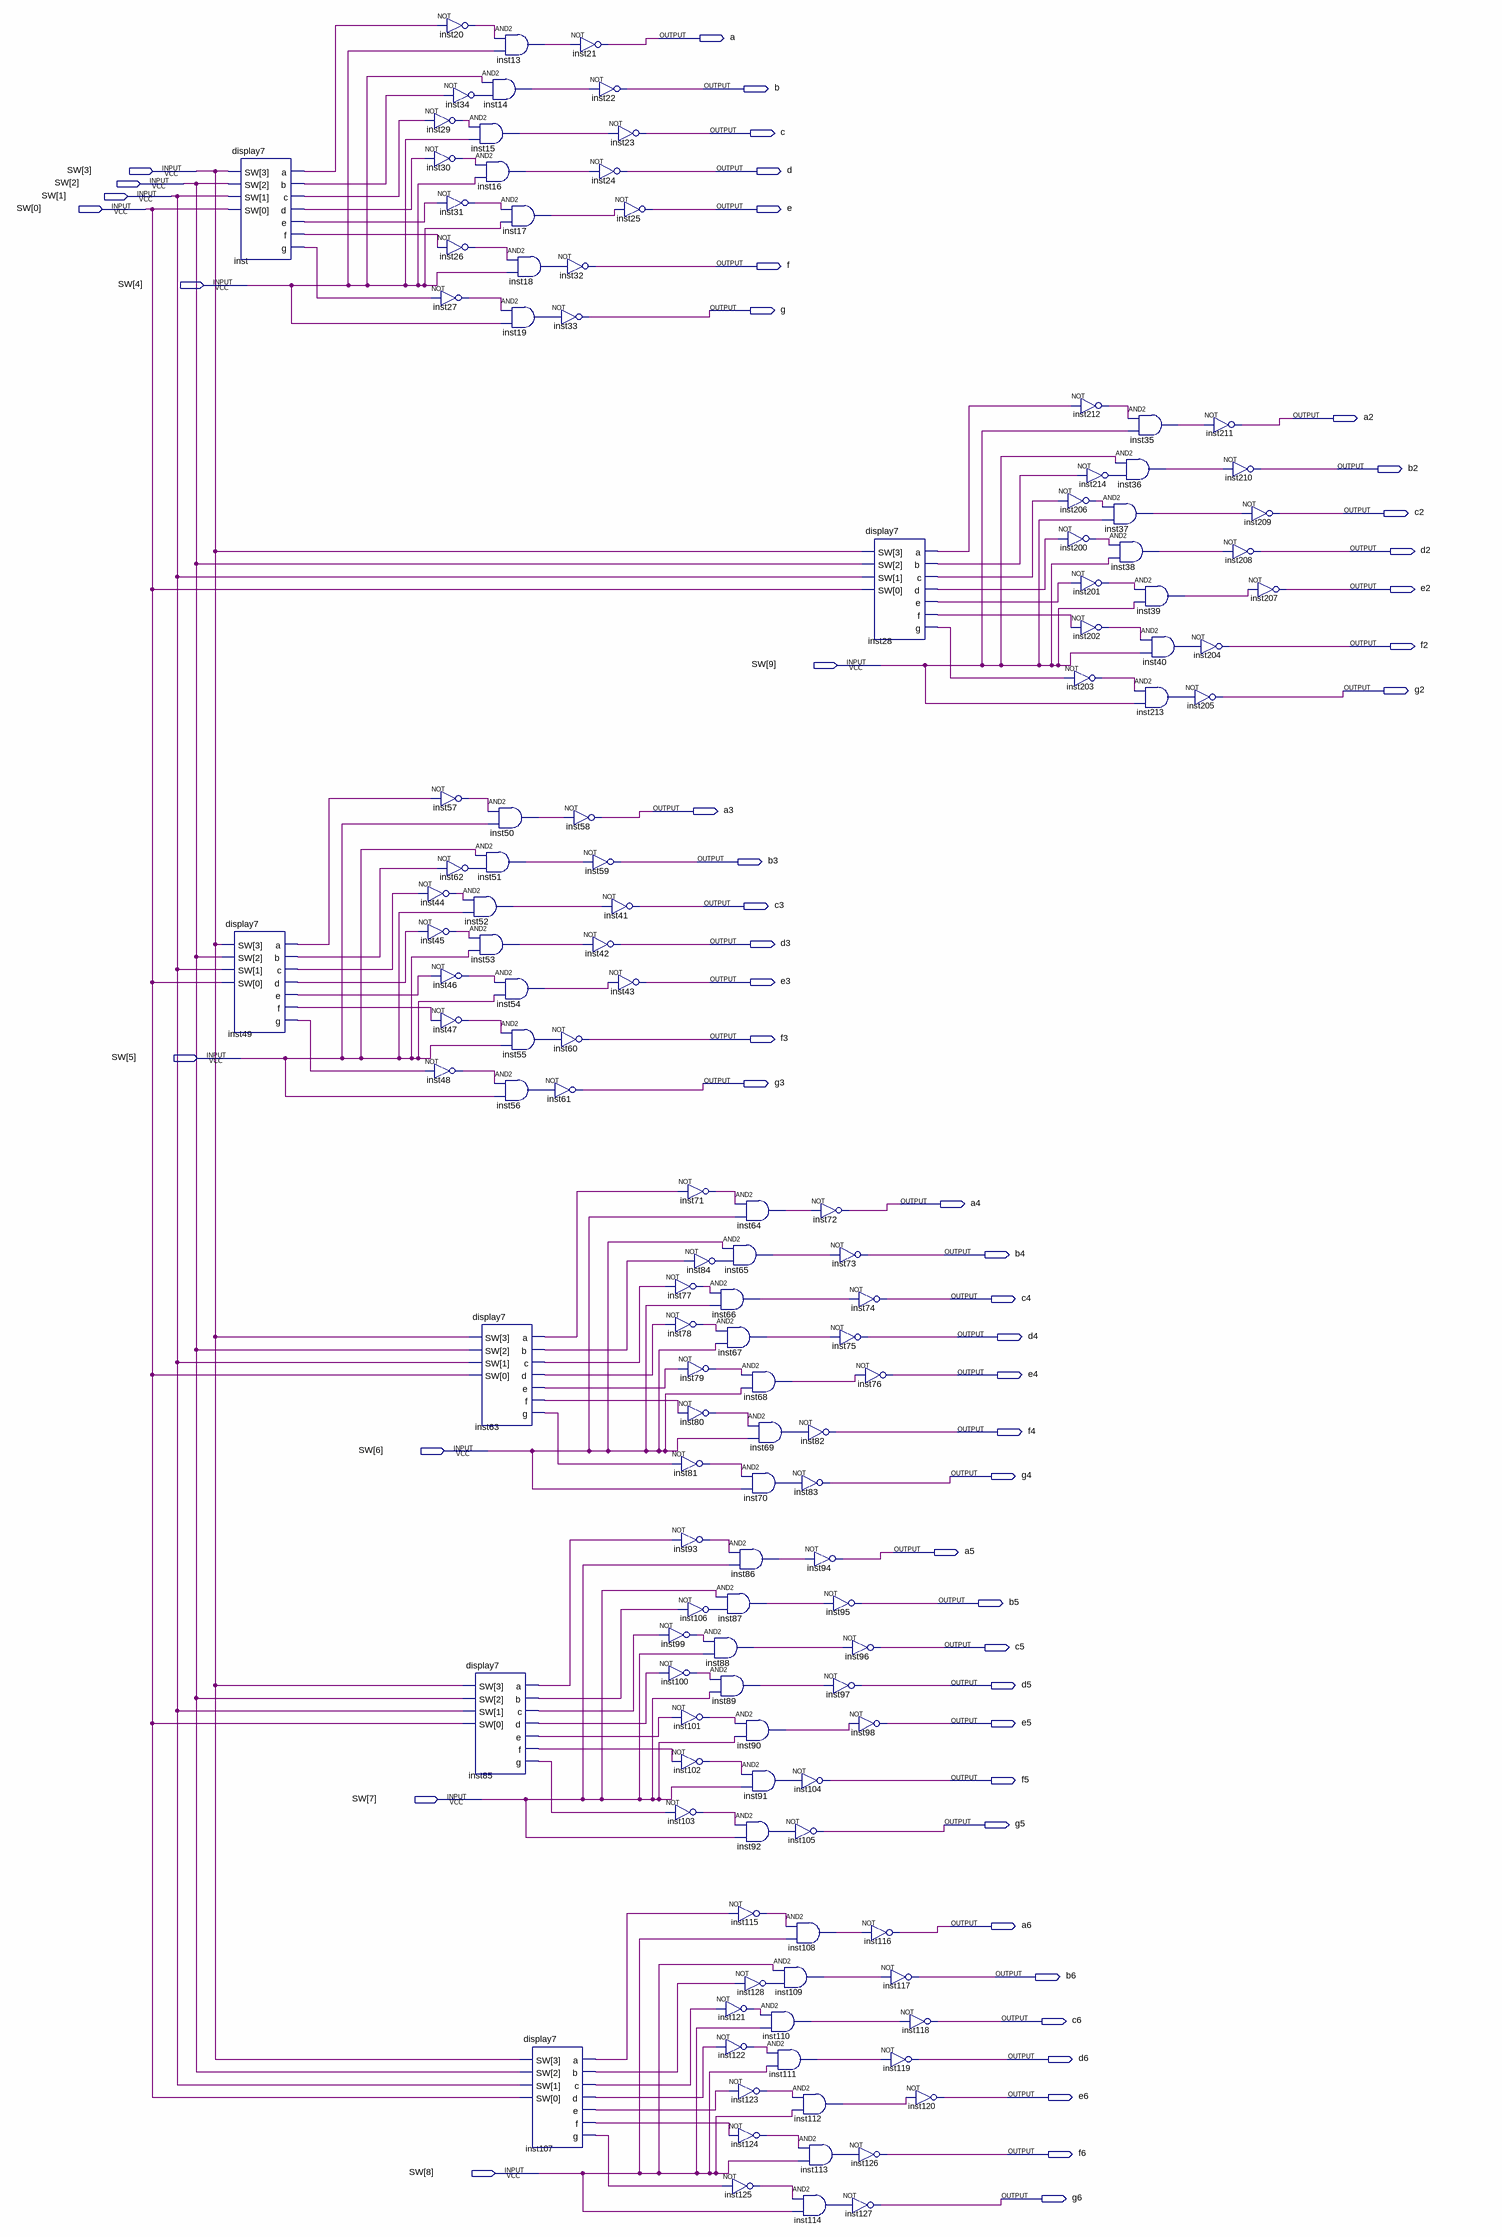
[diagram p0: schematic sheet]
// Quartus schematic display7_en.bdf as structural Verilog: 132 symbols, 52 pins
module display7_en (
  input  [9:0] SW,
  output a,
  output b,
  output c,
  output d,
  output e,
  output f,
  output g,
  output a2,
  output b2,
  output c2,
  output d2,
  output e2,
  output f2,
  output g2,
  output a3,
  output b3,
  output c3,
  output d3,
  output e3,
  output f3,
  output g3,
  output a4,
  output b4,
  output c4,
  output d4,
  output e4,
  output f4,
  output g4,
  output a5,
  output b5,
  output c5,
  output d5,
  output e5,
  output f5,
  output g5,
  output a6,
  output b6,
  output c6,
  output d6,
  output e6,
  output f6,
  output g6
);

  wire inst13_out, inst14_out, inst15_out, inst16_out, inst17_out, inst18_out, inst19_out, inst20_out,
       inst26_out, inst27_out, inst28_a, inst28_b, inst28_c, inst28_d, inst28_e, inst28_f, inst28_g,
       inst29_out, inst30_out, inst31_out, inst34_out, inst35_out, inst36_out, inst37_out, inst38_out,
       inst39_out, inst40_out, inst44_out, inst45_out, inst46_out, inst47_out, inst48_out, inst49_a,
       inst49_b, inst49_c, inst49_d, inst49_e, inst49_f, inst49_g, inst50_out, inst51_out, inst52_out,
       inst53_out, inst54_out, inst55_out, inst56_out, inst57_out, inst62_out, inst63_a, inst63_b, inst63_c,
       inst63_d, inst63_e, inst63_f, inst63_g, inst64_out, inst65_out, inst66_out, inst67_out, inst68_out,
       inst69_out, inst70_out, inst71_out, inst77_out, inst78_out, inst79_out, inst80_out, inst81_out,
       inst84_out, inst85_a, inst85_b, inst85_c, inst85_d, inst85_e, inst85_f, inst85_g, inst86_out,
       inst87_out, inst88_out, inst89_out, inst90_out, inst91_out, inst92_out, inst93_out, inst99_out,
       inst100_out, inst101_out, inst102_out, inst103_out, inst106_out, inst107_a, inst107_b, inst107_c,
       inst107_d, inst107_e, inst107_f, inst107_g, inst108_out, inst109_out, inst110_out, inst111_out,
       inst112_out, inst113_out, inst114_out, inst115_out, inst121_out, inst122_out, inst123_out,
       inst124_out, inst125_out, inst128_out, inst200_out, inst201_out, inst202_out, inst203_out,
       inst206_out, inst212_out, inst213_out, inst214_out, inst_a, inst_b, inst_c, inst_d, inst_e, inst_f,
       inst_g;

  display7 inst (.SW(SW[3:0]), .a(inst_a), .b(inst_b), .c(inst_c), .d(inst_d), .e(inst_e), .f(inst_f), .g(inst_g));
  display7 inst49 (
    .SW(SW[3:0]), .a(inst49_a), .b(inst49_b), .c(inst49_c), .d(inst49_d), .e(inst49_e), .f(inst49_f),
    .g(inst49_g));
  not inst20 (inst20_out, inst_a);
  not inst29 (inst29_out, inst_c);
  not inst30 (inst30_out, inst_d);
  not inst31 (inst31_out, inst_e);
  not inst26 (inst26_out, inst_f);
  not inst27 (inst27_out, inst_g);
  not inst57 (inst57_out, inst49_a);
  not inst62 (inst62_out, inst49_b);
  not inst44 (inst44_out, inst49_c);
  not inst45 (inst45_out, inst49_d);
  not inst46 (inst46_out, inst49_e);
  not inst47 (inst47_out, inst49_f);
  not inst48 (inst48_out, inst49_g);
  and inst14 (inst14_out, SW[4], inst34_out);
  not inst34 (inst34_out, inst_b);
  and inst15 (inst15_out, inst29_out, SW[4]);
  and inst16 (inst16_out, inst30_out, SW[4]);
  and inst50 (inst50_out, inst57_out, SW[5]);
  and inst51 (inst51_out, SW[5], inst62_out);
  and inst52 (inst52_out, inst44_out, SW[5]);
  and inst53 (inst53_out, inst45_out, SW[5]);
  display7 inst63 (
    .SW(SW[3:0]), .a(inst63_a), .b(inst63_b), .c(inst63_c), .d(inst63_d), .e(inst63_e), .f(inst63_f),
    .g(inst63_g));
  display7 inst85 (
    .SW(SW[3:0]), .a(inst85_a), .b(inst85_b), .c(inst85_c), .d(inst85_d), .e(inst85_e), .f(inst85_f),
    .g(inst85_g));
  and inst13 (inst13_out, inst20_out, SW[4]);
  and inst17 (inst17_out, inst31_out, SW[4]);
  and inst18 (inst18_out, inst26_out, SW[4]);
  and inst19 (inst19_out, inst27_out, SW[4]);
  and inst54 (inst54_out, inst46_out, SW[5]);
  and inst55 (inst55_out, inst47_out, SW[5]);
  and inst56 (inst56_out, inst48_out, SW[5]);
  display7 inst107 (
    .SW(SW[3:0]), .a(inst107_a), .b(inst107_b), .c(inst107_c), .d(inst107_d), .e(inst107_e), .f(inst107_f),
    .g(inst107_g));
  not inst21 (a, inst13_out);
  not inst22 (b, inst14_out);
  not inst24 (d, inst16_out);
  not inst32 (f, inst18_out);
  not inst33 (g, inst19_out);
  not inst58 (a3, inst50_out);
  not inst59 (b3, inst51_out);
  not inst42 (d3, inst53_out);
  not inst60 (f3, inst55_out);
  not inst61 (g3, inst56_out);
  not inst23 (c, inst15_out);
  not inst25 (e, inst17_out);
  not inst41 (c3, inst52_out);
  not inst43 (e3, inst54_out);
  not inst71 (inst71_out, inst63_a);
  not inst84 (inst84_out, inst63_b);
  not inst77 (inst77_out, inst63_c);
  not inst78 (inst78_out, inst63_d);
  not inst79 (inst79_out, inst63_e);
  not inst80 (inst80_out, inst63_f);
  not inst81 (inst81_out, inst63_g);
  not inst93 (inst93_out, inst85_a);
  not inst106 (inst106_out, inst85_b);
  not inst99 (inst99_out, inst85_c);
  not inst100 (inst100_out, inst85_d);
  not inst101 (inst101_out, inst85_e);
  not inst102 (inst102_out, inst85_f);
  not inst103 (inst103_out, inst85_g);
  and inst64 (inst64_out, inst71_out, SW[6]);
  and inst65 (inst65_out, SW[6], inst84_out);
  and inst66 (inst66_out, inst77_out, SW[6]);
  and inst67 (inst67_out, inst78_out, SW[6]);
  and inst68 (inst68_out, inst79_out, SW[6]);
  and inst70 (inst70_out, inst81_out, SW[6]);
  and inst86 (inst86_out, inst93_out, SW[7]);
  and inst87 (inst87_out, SW[7], inst106_out);
  and inst88 (inst88_out, inst99_out, SW[7]);
  and inst89 (inst89_out, inst100_out, SW[7]);
  and inst90 (inst90_out, inst101_out, SW[7]);
  and inst91 (inst91_out, inst102_out, SW[7]);
  and inst92 (inst92_out, inst103_out, SW[7]);
  not inst115 (inst115_out, inst107_a);
  not inst128 (inst128_out, inst107_b);
  not inst121 (inst121_out, inst107_c);
  not inst122 (inst122_out, inst107_d);
  not inst123 (inst123_out, inst107_e);
  not inst124 (inst124_out, inst107_f);
  not inst125 (inst125_out, inst107_g);
  and inst69 (inst69_out, inst80_out, SW[6]);
  not inst83 (g4, inst70_out);
  not inst104 (f5, inst91_out);
  not inst105 (g5, inst92_out);
  and inst108 (inst108_out, inst115_out, SW[8]);
  and inst109 (inst109_out, SW[8], inst128_out);
  and inst110 (inst110_out, inst121_out, SW[8]);
  and inst111 (inst111_out, inst122_out, SW[8]);
  and inst112 (inst112_out, inst123_out, SW[8]);
  and inst114 (inst114_out, inst125_out, SW[8]);
  not inst72 (a4, inst64_out);
  not inst73 (b4, inst65_out);
  not inst75 (d4, inst67_out);
  not inst82 (f4, inst69_out);
  not inst94 (a5, inst86_out);
  not inst95 (b5, inst87_out);
  not inst96 (c5, inst88_out);
  not inst97 (d5, inst89_out);
  and inst113 (inst113_out, inst124_out, SW[8]);
  not inst127 (g6, inst114_out);
  display7 inst28 (
    .SW(SW[3:0]), .a(inst28_a), .b(inst28_b), .c(inst28_c), .d(inst28_d), .e(inst28_e), .f(inst28_f),
    .g(inst28_g));
  not inst74 (c4, inst66_out);
  not inst76 (e4, inst68_out);
  not inst98 (e5, inst90_out);
  not inst116 (a6, inst108_out);
  not inst117 (b6, inst109_out);
  not inst119 (d6, inst111_out);
  not inst126 (f6, inst113_out);
  not inst118 (c6, inst110_out);
  not inst120 (e6, inst112_out);
  not inst212 (inst212_out, inst28_a);
  not inst214 (inst214_out, inst28_b);
  not inst206 (inst206_out, inst28_c);
  not inst200 (inst200_out, inst28_d);
  not inst201 (inst201_out, inst28_e);
  not inst202 (inst202_out, inst28_f);
  not inst203 (inst203_out, inst28_g);
  and inst35 (inst35_out, inst212_out, SW[9]);
  and inst36 (inst36_out, SW[9], inst214_out);
  and inst37 (inst37_out, inst206_out, SW[9]);
  and inst38 (inst38_out, inst200_out, SW[9]);
  and inst39 (inst39_out, inst201_out, SW[9]);
  and inst40 (inst40_out, inst202_out, SW[9]);
  and inst213 (inst213_out, inst203_out, SW[9]);
  not inst204 (f2, inst40_out);
  not inst205 (g2, inst213_out);
  not inst211 (a2, inst35_out);
  not inst210 (b2, inst36_out);
  not inst209 (c2, inst37_out);
  not inst208 (d2, inst38_out);
  not inst207 (e2, inst39_out);
endmodule
